# EAGLE design untitled_front4 (EAGLE 9.2.2)
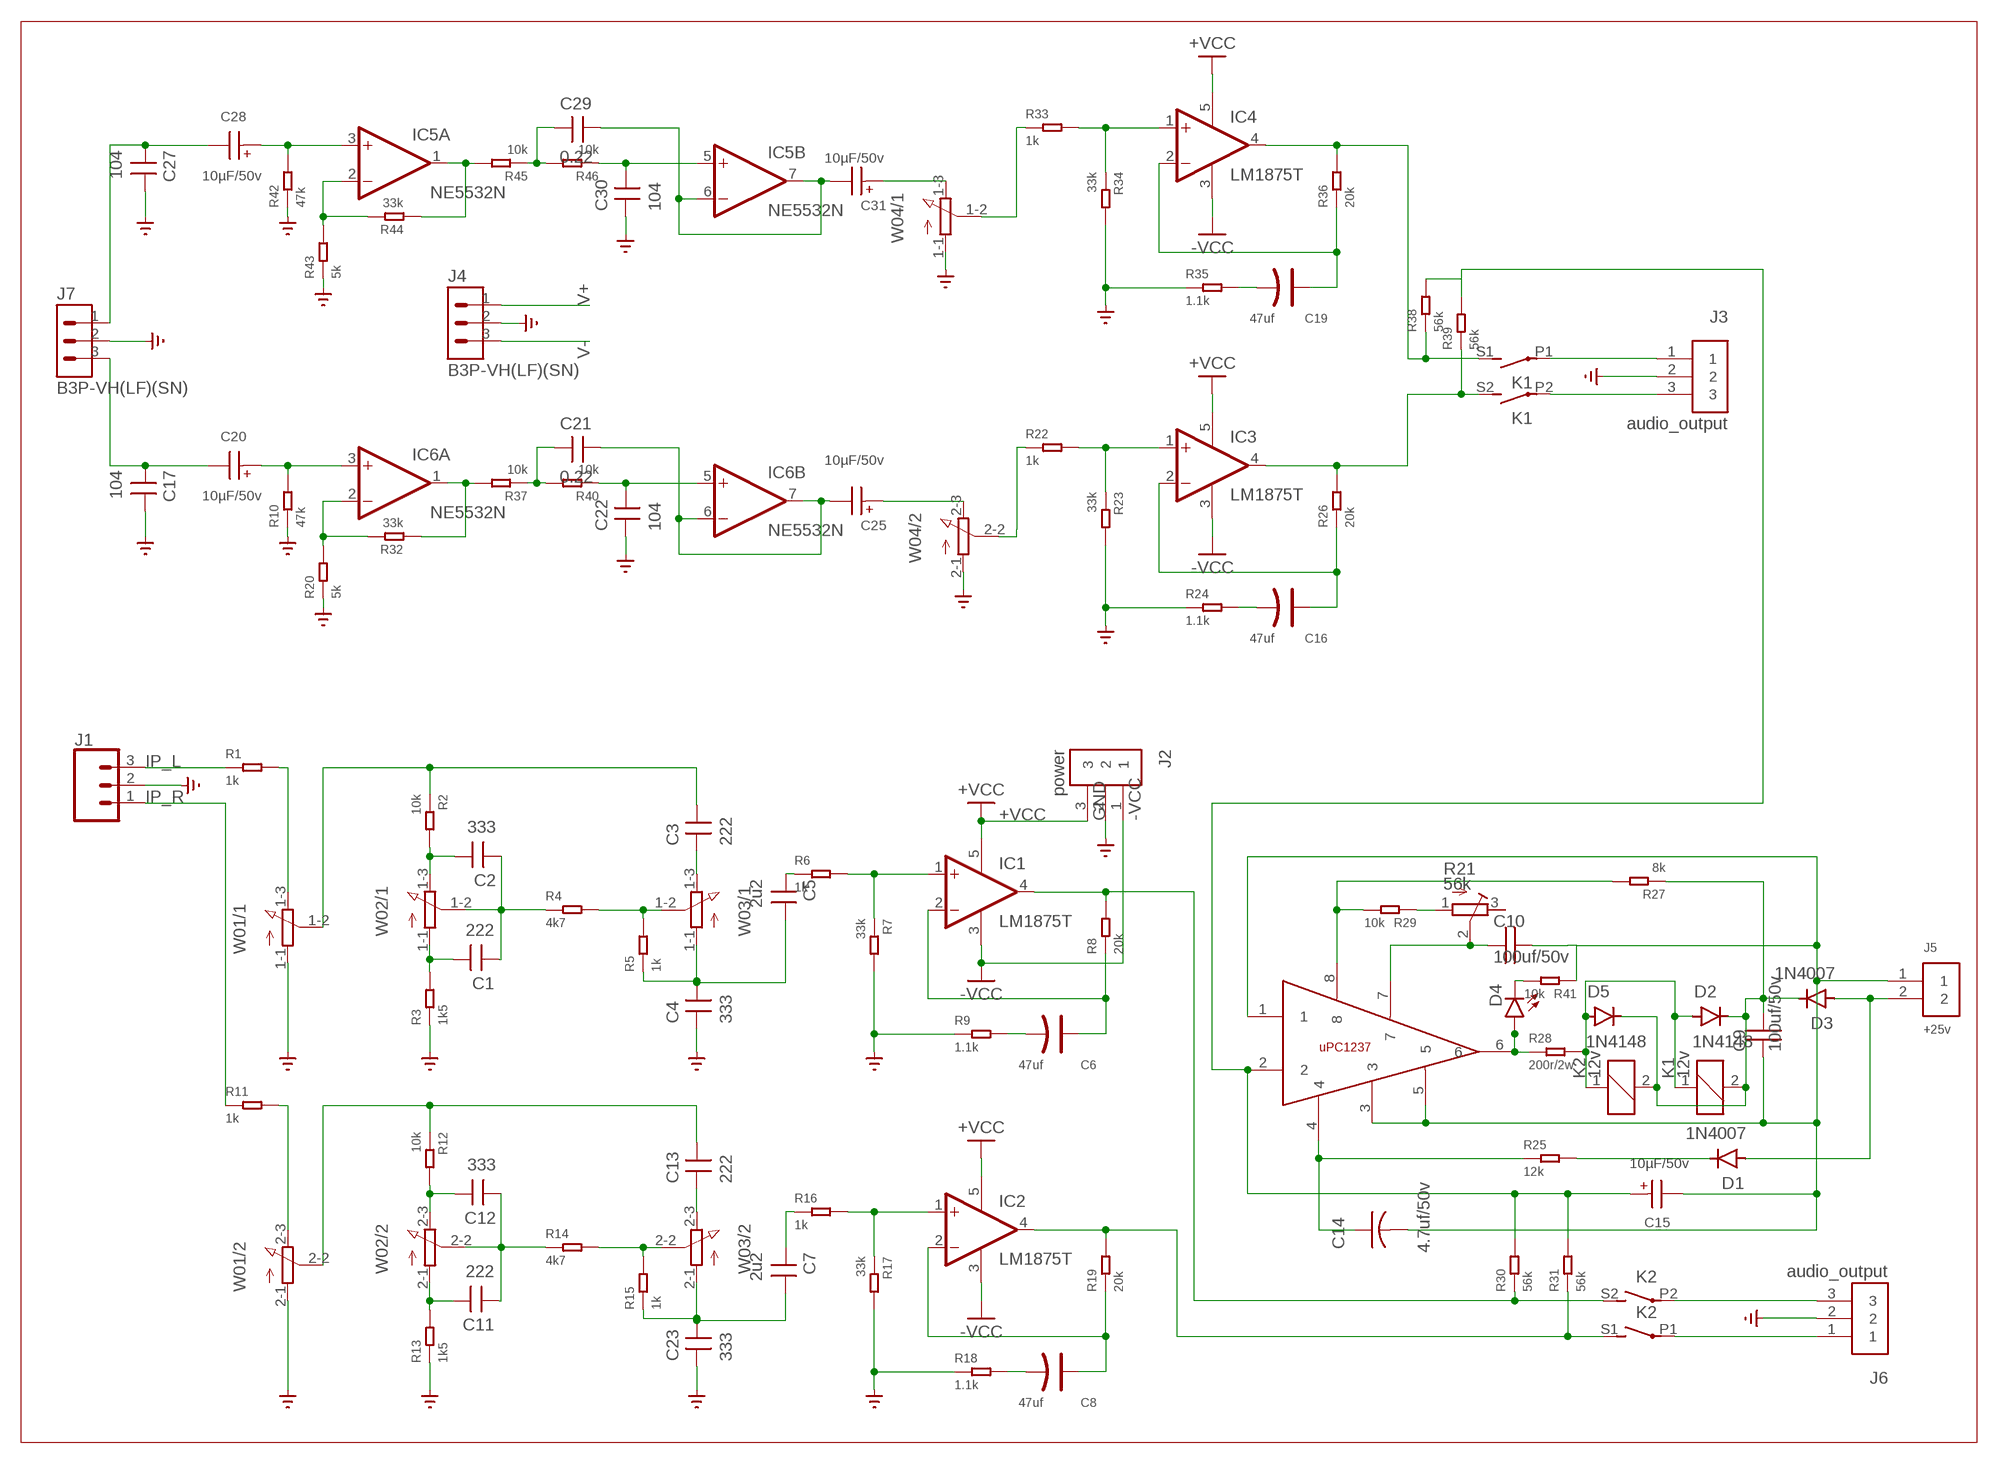
[diagram p0: schematic, sheet 1]

## Parts
C1  222  5.08MM-  [5.08MM-独石电容]
C2  333  5.08MM-  [5.08MM-独石电容]
C3  222  5.08MM-  [5.08MM-独石电容]
C4  333  5.08MM-  [5.08MM-独石电容]
C5  2u2  5.08MM-  [5.08MM-独石电容]
C6  47uf  DIP-ALUMINUM-47UF-16V(D5-H7MM)  [PC-D5.3MM]
C7  2u2  5.08MM-  [5.08MM-独石电容]
C8  47uf  DIP-ALUMINUM-47UF-16V(D5-H7MM)  [PC-D5.3MM]
C9  100uf/50v  50V100UF8X12  [8X12]
C10  100uf/50v  50V100UF8X12  [8X12]
C11  222  5.08MM-  [5.08MM-独石电容]
C12  333  5.08MM-  [5.08MM-独石电容]
C13  222  5.08MM-  [5.08MM-独石电容]
C14  4.7uf/50v  ECA-1HM2R2  [CAP_RADIAL_2MM]
C15  10µF/50v  WCAP-AT1H_5X11_860240272001  [WCAP-AT1H_5X11(DXL)]
C16  47uf  DIP-ALUMINUM-47UF-16V(D5-H7MM)  [PC-D5.3MM]
C17  104  5.08MM-  [5.08MM-独石电容]
C19  47uf  DIP-ALUMINUM-47UF-16V(D5-H7MM)  [PC-D5.3MM]
C20  10µF/50v  WCAP-AT1H_5X11_860240272001  [WCAP-AT1H_5X11(DXL)]
C21  0.22  5.08MM-  [5.08MM-独石电容]
C22  104  5.08MM-  [5.08MM-独石电容]
C23  333  5.08MM-  [5.08MM-独石电容]
C25  10µF/50v  WCAP-AT1H_5X11_860240272001  [WCAP-AT1H_5X11(DXL)]
C27  104  5.08MM-  [5.08MM-独石电容]
C28  10µF/50v  WCAP-AT1H_5X11_860240272001  [WCAP-AT1H_5X11(DXL)]
C29  0.22  5.08MM-  [5.08MM-独石电容]
C30  104  5.08MM-  [5.08MM-独石电容]
C31  10µF/50v  WCAP-AT1H_5X11_860240272001  [WCAP-AT1H_5X11(DXL)]
D1  1N4007  [DO-41]
D2  1N4148  1N4007  [DO-41]
D3  1N4007  [DO-41]
D4  BEAGLEBONE_BLUE_LED-3MM-NO_SILK  [BEAGLEBONE_BLUE_BEAGLEBONE_BLUE_LED3MM-NS]
D5  1N4148  1N4007  [DO-41]
IC1  LM1875T  [CB367]
IC2  LM1875T  [CB367]
IC3  LM1875T  [CB367]
IC4  LM1875T  [CB367]
IC5  NE5532N  [DIL08]
IC6  NE5532N  [DIL08]
J1  CONN_03POLAR  [MOLEX-1X3]
J2  power  691311400103  [TERMINALBLOCK_PLUGGABLE-3-7.62MM]
J3  audio_output  691311400103  [TERMINALBLOCK_PLUGGABLE-3-7.62MM]
J4  B3P-VH(LF)(SN)  [HDR-03]
J5  +25v  S2B-PH-K-S(LF)(SN)  [S2B-PH-K-S(LF)(SN)]
J6  audio_output  691311400103  [TERMINALBLOCK_PLUGGABLE-3-7.62MM]
J7  B3P-VH(LF)(SN)  [HDR-03]
K1  12v  G2R2A  [G2R2A]
K2  12v  G2R2A  [G2R2A]
R1  1k  DIP-RES-1M-5%-1/4W(PR-D2.3XL6.5MM)  [PR-D2.3XL6.5MM]
R2  10k  DIP-RES-1M-5%-1/4W(PR-D2.3XL6.5MM)  [PR-D2.3XL6.5MM]
R3  1k5  DIP-RES-1M-5%-1/4W(PR-D2.3XL6.5MM)  [PR-D2.3XL6.5MM]
R4  4k7  DIP-RES-1M-5%-1/4W(PR-D2.3XL6.5MM)  [PR-D2.3XL6.5MM]
R5  1k  DIP-RES-1M-5%-1/4W(PR-D2.3XL6.5MM)  [PR-D2.3XL6.5MM]
R6  1k  DIP-RES-1M-5%-1/4W(PR-D2.3XL6.5MM)  [PR-D2.3XL6.5MM]
R7  33k  DIP-RES-1M-5%-1/4W(PR-D2.3XL6.5MM)  [PR-D2.3XL6.5MM]
R8  20k  DIP-RES-1M-5%-1/4W(PR-D2.3XL6.5MM)  [PR-D2.3XL6.5MM]
R9  1.1k  DIP-RES-1M-5%-1/4W(PR-D2.3XL6.5MM)  [PR-D2.3XL6.5MM]
R10  47k  DIP-RES-1M-5%-1/4W(PR-D2.3XL6.5MM)  [PR-D2.3XL6.5MM]
R11  1k  DIP-RES-1M-5%-1/4W(PR-D2.3XL6.5MM)  [PR-D2.3XL6.5MM]
R12  10k  DIP-RES-1M-5%-1/4W(PR-D2.3XL6.5MM)  [PR-D2.3XL6.5MM]
R13  1k5  DIP-RES-1M-5%-1/4W(PR-D2.3XL6.5MM)  [PR-D2.3XL6.5MM]
R14  4k7  DIP-RES-1M-5%-1/4W(PR-D2.3XL6.5MM)  [PR-D2.3XL6.5MM]
R15  1k  DIP-RES-1M-5%-1/4W(PR-D2.3XL6.5MM)  [PR-D2.3XL6.5MM]
R16  1k  DIP-RES-1M-5%-1/4W(PR-D2.3XL6.5MM)  [PR-D2.3XL6.5MM]
R17  33k  DIP-RES-1M-5%-1/4W(PR-D2.3XL6.5MM)  [PR-D2.3XL6.5MM]
R18  1.1k  DIP-RES-1M-5%-1/4W(PR-D2.3XL6.5MM)  [PR-D2.3XL6.5MM]
R19  20k  DIP-RES-1M-5%-1/4W(PR-D2.3XL6.5MM)  [PR-D2.3XL6.5MM]
R20  5k  DIP-RES-1M-5%-1/4W(PR-D2.3XL6.5MM)  [PR-D2.3XL6.5MM]
R21  56k  R-TRIMM3296W  [RTRIM3296W]
R22  1k  DIP-RES-1M-5%-1/4W(PR-D2.3XL6.5MM)  [PR-D2.3XL6.5MM]
R23  33k  DIP-RES-1M-5%-1/4W(PR-D2.3XL6.5MM)  [PR-D2.3XL6.5MM]
R24  1.1k  DIP-RES-1M-5%-1/4W(PR-D2.3XL6.5MM)  [PR-D2.3XL6.5MM]
R25  12k  DIP-RES-1M-5%-1/4W(PR-D2.3XL6.5MM)  [PR-D2.3XL6.5MM]
R26  20k  DIP-RES-1M-5%-1/4W(PR-D2.3XL6.5MM)  [PR-D2.3XL6.5MM]
R27  8k  DIP-RES-1M-5%-1/4W(PR-D2.3XL6.5MM)  [PR-D2.3XL6.5MM]
R28  200r/2w  DIP-RES-1M-5%-1/4W(PR-D2.3XL6.5MM)  [PR-D2.3XL6.5MM]
R29  10k  DIP-RES-1M-5%-1/4W(PR-D2.3XL6.5MM)  [PR-D2.3XL6.5MM]
R30  56k  DIP-RES-1M-5%-1/4W(PR-D2.3XL6.5MM)  [PR-D2.3XL6.5MM]
R31  56k  DIP-RES-1M-5%-1/4W(PR-D2.3XL6.5MM)  [PR-D2.3XL6.5MM]
R32  33k  DIP-RES-1M-5%-1/4W(PR-D2.3XL6.5MM)  [PR-D2.3XL6.5MM]
R33  1k  DIP-RES-1M-5%-1/4W(PR-D2.3XL6.5MM)  [PR-D2.3XL6.5MM]
R34  33k  DIP-RES-1M-5%-1/4W(PR-D2.3XL6.5MM)  [PR-D2.3XL6.5MM]
R35  1.1k  DIP-RES-1M-5%-1/4W(PR-D2.3XL6.5MM)  [PR-D2.3XL6.5MM]
R36  20k  DIP-RES-1M-5%-1/4W(PR-D2.3XL6.5MM)  [PR-D2.3XL6.5MM]
R37  10k  DIP-RES-1M-5%-1/4W(PR-D2.3XL6.5MM)  [PR-D2.3XL6.5MM]
R38  56k  DIP-RES-1M-5%-1/4W(PR-D2.3XL6.5MM)  [PR-D2.3XL6.5MM]
R39  56k  DIP-RES-1M-5%-1/4W(PR-D2.3XL6.5MM)  [PR-D2.3XL6.5MM]
R40  10k  DIP-RES-1M-5%-1/4W(PR-D2.3XL6.5MM)  [PR-D2.3XL6.5MM]
R41  10k  DIP-RES-1M-5%-1/4W(PR-D2.3XL6.5MM)  [PR-D2.3XL6.5MM]
R42  47k  DIP-RES-1M-5%-1/4W(PR-D2.3XL6.5MM)  [PR-D2.3XL6.5MM]
R43  5k  DIP-RES-1M-5%-1/4W(PR-D2.3XL6.5MM)  [PR-D2.3XL6.5MM]
R44  33k  DIP-RES-1M-5%-1/4W(PR-D2.3XL6.5MM)  [PR-D2.3XL6.5MM]
R45  10k  DIP-RES-1M-5%-1/4W(PR-D2.3XL6.5MM)  [PR-D2.3XL6.5MM]
R46  10k  DIP-RES-1M-5%-1/4W(PR-D2.3XL6.5MM)  [PR-D2.3XL6.5MM]
U2  UPC1237HA  [SIP8]
W01  3RP/1610G  [3RP/1610G]
W02  3RP/1610G  [3RP/1610G]
W03  3RP/1610G  [3RP/1610G]
W04  3RP/1610G  [3RP/1610G]

## Nets
+VCC: IC1.5(V+) IC2.5(V+) IC3.5(V+) IC4.5(V+) J2.3
-VCC: IC1.3(V-) IC2.3(V-) IC3.3(V-) IC4.3(V-) J2.1
GND: C4.P$2 C17.P$1 C22.P$2 C23.P$2 C27.P$1 C30.P$2 J1.2 J2.2 J3.2 J4.2 J6.2 J7.2 R3.1 R7.2 R9.1 R10.1 R13.1 R17.2 R18.1 R20.1 R23.2 R24.1 R34.2 R35.1 R42.1 R43.1 W01.1-1(/1:A) W01.2-1(/2:A) W04.1-1(/1:A) W04.2-1(/2:A) ; supply symbol labelled SUPPLY0_GND_
IP_L: J1.3 R1.1
IP_R: J1.1 R11.1
N$1: R1.2 W01.1-3(/1:E)
N$2: D4.K(C) R41.2
N$3: C2.P$1 R2.2 W02.1-3(/1:E)
N$4: C1.P$1 R3.2 W02.1-1(/1:A)
N$5: R4.2 R5.2 W03.1-2(/1:S)
N$6: C1.P$2 C2.P$2 R4.1 W02.1-2(/1:S)
N$7: IC1.1(+IN) R6.2 R7.1
N$8: C4.P$1 C5.P$1 R5.1 W03.1-1(/1:A)
N$9: IC1.4(OUT) K2.S2(3:S) R8.2 R30.1
N$10: C6.+ IC1.2(-IN) R8.1
N$11: C5.P$2 R6.1
N$12: C6.- R9.2
N$13: C17.P$2 C20.2(-) J7.3
N$14: C3.P$2 W03.1-3(/1:E)
N$15: R11.2 W01.2-3(/2:E)
N$16: C27.P$2 C28.2(-) J7.1
N$17: C12.P$1 R12.2 W02.2-3(/2:E)
N$18: C11.P$1 R13.2 W02.2-1(/2:A)
N$19: R14.2 R15.2 W03.2-2(/2:S)
N$20: C11.P$2 C12.P$2 R14.1 W02.2-2(/2:S)
N$21: C7.P$1 C23.P$1 R15.1 W03.2-1(/2:A)
N$22: IC2.1(+IN) R16.2 R17.1
N$23: IC2.4(OUT) K2.S1(2:S) R19.2 R31.1
N$24: C8.+ IC2.2(-IN) R19.1
N$25: C7.P$2 R16.1
N$26: C8.- R18.2
N$27: C20.1(+) IC6.3(A:+IN) R10.2
N$28: C13.P$2 W03.2-3(/2:E)
N$29: J6.1 K2.P1(2:P)
N$30: J6.3 K2.P2(3:P)
N$31: D1.C R25.2
N$32: C10.1 R21.2(S) U2.7
N$33: R33.1 W04.1-2(/1:S)
N$34: IC3.1(+IN) R22.2 R23.1
N$35: IC3.4(OUT) K1.S2(3:S) R26.2 R39.1
N$36: C16.+ IC3.2(-IN) R26.1
N$37: R22.1 W04.2-2(/2:S)
N$38: C16.- R24.2
N$39: IC6.2(A:-IN) R20.2 R32.2
N$40: D1.A D3.A J5.2
N$41: D4.A R28.1 U2.6
N$42: D2.A D5.A K1.1 K2.1 R28.2
N$43: C9.2 D2.C D3.C D5.C K1.2 K2.2 R27.1
N$44: R27.2 R29.2 U2.8
N$45: R21.1(A) R29.1
N$46: J3.3 K1.P2(3:P)
N$47: C14.1 R25.1 U2.4
N$48: C15.1(+) R30.2 R31.2 R38.2 R39.2 U2.2
N$49: C28.1(+) IC5.3(A:+IN) R42.2
N$50: IC4.1(+IN) R33.2 R34.1
N$51: IC4.4(OUT) K1.S1(2:S) R36.2 R38.1
N$52: C19.+ IC4.2(-IN) R36.1
N$53: C3.P$1 R2.1 W01.1-2(/1:S)
N$54: C19.- R35.2
N$55: IC6.1(A:OUT) R32.1 R37.2
N$56: C9.1 C10.2 C14.2 C15.2(-) J5.1 R41.1 U2.1 U2.3 U2.5
N$57: J3.1 K1.P1(2:P)
N$58: C13.P$1 R12.1 W01.2-2(/2:S)
N$59: C21.P$2 R37.1 R40.2
N$60: C22.P$1 IC6.5(B:+IN) R40.1
N$61: C21.P$1 C25.2(-) IC6.6(B:-IN) IC6.7(B:OUT)
N$62: C29.P$1 C31.2(-) IC5.6(B:-IN) IC5.7(B:OUT)
N$63: IC5.2(A:-IN) R43.2 R44.2
N$64: IC5.1(A:OUT) R44.1 R45.2
N$65: C29.P$2 R45.1 R46.2
N$66: C30.P$1 IC5.5(B:+IN) R46.1
N$68: C31.1(+) W04.1-3(/1:E)
N$69: C25.1(+) W04.2-3(/2:E)
V+: J4.1
V-: J4.3
Unconnected: R21.3(E)

## Power pins joined to a net without a drawn wire
V+: IC5.8(P:V+) IC6.8(P:V+)
V-: IC5.4(P:V-) IC6.4(P:V-)

## Library data of the parts
C1-C5 C7 C11-C13 C17 C21-C23 C27 C29 C30 = Audio-Power-amlifier:5.08MM-; LONG: 5.08mm
C6 C8 C16 C19 = OPL_Capacitor:DIP-ALUMINUM-47UF-16V(D5-H7MM): 302030033; MPN: KS 100uF/16V; VALUE: 100uf
C9 C10 = Audio-Power-amlifier:50V100UF8X12
C14 = Resistor_Capacitor:ECA-1HM2R2: CAP ALUM 2.2UF 20% 50V RADIAL Manufacturer's datasheet <https://media.digikey.com/pdf/Data%20Sheets/Panasonic%20Electronic%20Components/ECA-xxM%20Series,TypeA.pdf>; CREATED_BY: PCBLayout.com; DIGIKEY_PART_NUMBER: P5175-ND; MANUFACTURER: Panasonic Electronic Components; MPN: ECA-1HM2R2; PACKAGE: CAP RADIAL 2MM LS
C15 C20 C25 C28 C31 = Wurth_Capacitors_WCAP-AT1H:WCAP-AT1H_5X11: WCAP-AT1H Aluminium Electrolytic Capacitors Long Life +105 °C Characteristics Long life product series Mounting style: THT Radial Capacitance range: 6.8 µF ‒ 3300 µF Capacitance tolerance: ±20 % Voltage range (UR): 10 ‒ 450 V(DC) Operating temperature: -40 °C up to +105 °C for UR ≤100 V(DC) -25 °C up to +105 °C for UR > 100 V(DC) Endurance: 5000 ‒ 10000 h @ +105 °C Dimensions (DxL) in mm: 5.0 x 11.0 up to 18.0 x 35.5 Recommended soldering: Wave soldering Applications Long life applications (industry, medical) Filtering Smoothing Energy storage Coupling e.g. Switched-mode power supply, AC/DC converter, adapter, charger, digital camera <https://www.we-online.com/catalog/media/o14727v209%20Family_WCAP-AT1H.jpg> Details see: https://www.we-online.com/catalog/en/WCAP-AT1H/ Updated by yingchun,Shan;2020-02-28 2020(C) Würth Elektronik; DATASHEET-URL: https://www.we-online.com/catalog/datasheet/860240272001.pdf; DF: 19%; DIAMETER: 5mm; I-LEAK: 4.7uA; I-RIPPLE: 100mA; L: 11mm; OPERATING-TEMPERATURE: -40 °C up to +105 °C; PART-NUMBER: 860240272001; PITCH: 2mm; TECHNICAL-REFERENCE: ATDC110470M010DSPA3E000; VALUE: 47 µF; VR: 10V(DC)
D1-D3 D5 = Diodes:1N4007: DIODE GEN PURP 1KV 1A DO41 Manufacturer's datasheet <https://www.mccsemi.com/pdf/Products/1N4001-1N4007(DO-41).pdf>; CREATED_BY: PCBLayout.com; DIGIKEY_PART_NUMBER: 1N4007MSCT-ND; MANUFACTURER: Micro Commercial Co; MPN: 1N4007; PACKAGE: DO-41
D4 = BeagleBone_Blue_R3:BEAGLEBONE_BLUE_LED: LEDs Standard schematic elements and footprints for 5mm, 3mm, 1206, and 0603 sized LEDs. 5mm - Spark Fun Electronics SKU : COM-00529 (and others)
IC1-IC4 = linear:LM1875T: Power OP AMP
IC5 IC6 = linear:NE5532: AUDIO AMPLIFIER
J1 = SparkFun-Connectors:CONN_03: Multi connection point. Often used as Generic Header-pin footprint for 0.1 inch spaced/style header connections On any of the 0.1 inch spaced packages, you can populate with these: Break Away Headers - Straight <https://www.sparkfun.com/products/116> (PRT-00116) Break Away Male Headers - Right Angle <https://www.sparkfun.com/products/553> (PRT-00553) Female Headers <https://www.sparkfun.com/products/115> (PRT-00115) Break Away Headers - Machine Pin <https://www.sparkfun.com/products/117> (PRT-00117) Break Away Female Headers - Swiss Machine Pin <https://www.sparkfun.com/products/743> (PRT-00743) Stackable Header - 3 Pin (Female, 0.1") <https://www.sparkfun.com/products/13875> (PRT-13875) For SCREWTERMINALS and SPRING TERMINALS visit here: Screw Terimnals on SparkFun.com <https://www.sparkfun.com/search/results?term=Screw+Terminals> (5mm/3.5mm/2.54mm spacing) This device is also useful as a general connection point to wire up your design to another part of your project. Our various solder wires solder well into these plated through hole pads. Hook-Up Wire - Assortment (Stranded, 22 AWG) <https://www.sparkfun.com/products/11375> (PRT-11375) Hook-Up Wire - Assortment (Solid Core, 22 AWG) <https://www.sparkfun.com/products/11367> (PRT-11367) View the entire wire category on our website here <https://www.sparkfun.com/categories/141> Special notes: Molex polarized connector foot print use with SKU : PRT-08232 with associated crimp pins and housings.; PROD_ID: CONN-08625; SF_ID: PRT-08096
J2 J3 J6 = Terminal Blocks:691311400103: 7.62MM CLOSE VERTICAL PCB HEADER WR-TBL Manufacturer's datasheet <https://katalog.we-online.com/em/datasheet/6913114001xx.pdf>; CREATED_BY: PCBLayout.com; DIGIKEY_PART_NO: 732-2824-ND; MANUFACTURER: WURTH ELEKTRONIK; MPN: 691311400103
J4 J7 = Connectors:B3P-VH(LF)(SN): CONN HEADER VERT 3POS 3.96MM Manufacturer's datasheet <http://www.jst-mfg.com/product/pdf/eng/eVH.pdf>; CREATED_BY: PCBLayout.com; DIGIKEY_PART_NUMBER: 455-1640-ND; MANUFACTURER: JST Sales America Inc.; MPN: B3P-VH(LF)(SN)
J5 = Connectors:S2B-PH-K-S(LF)(SN): CONN HEADER R/A 2POS 2MM Manufacturer's datasheet <http://www.jst-mfg.com/product/pdf/eng/ePH.pdf>; CREATED_BY: PCBLayout.com; DIGI_KEY_PART_NUMBER: 455-1719-ND; MANUFACTURER: JST Sales America Inc.; MPN: S2B-PH-K-S(LF)(SN)
K1 K2 = relay:G2R2A: RELAY 2 x norm. open, Omron; MPN: G2R-2A-DC24; OC_FARNELL: 6985269; OC_NEWARK: 36M5257
R1-R20 R22-R46 = OPL_Resistor:DIP-RES-1M-5%-1/4W(PR-D2.3XL6.5MM): 301020005; MPN: FHCFR-1/4W-105J; VALUE: 1M
R21 = rcl:R-TRIMM: Trimm resistor; SPICEMODEL: X; SPICEPREFIXL: POT
U2 = Audio-Power-amlifier:UPC1237HA
W01-W04 = pot:3RP/1610G: 16mm Potentiometer two level Source: http://www.alphapotentiometers.net/html/16mm_pot_2.html

## Board
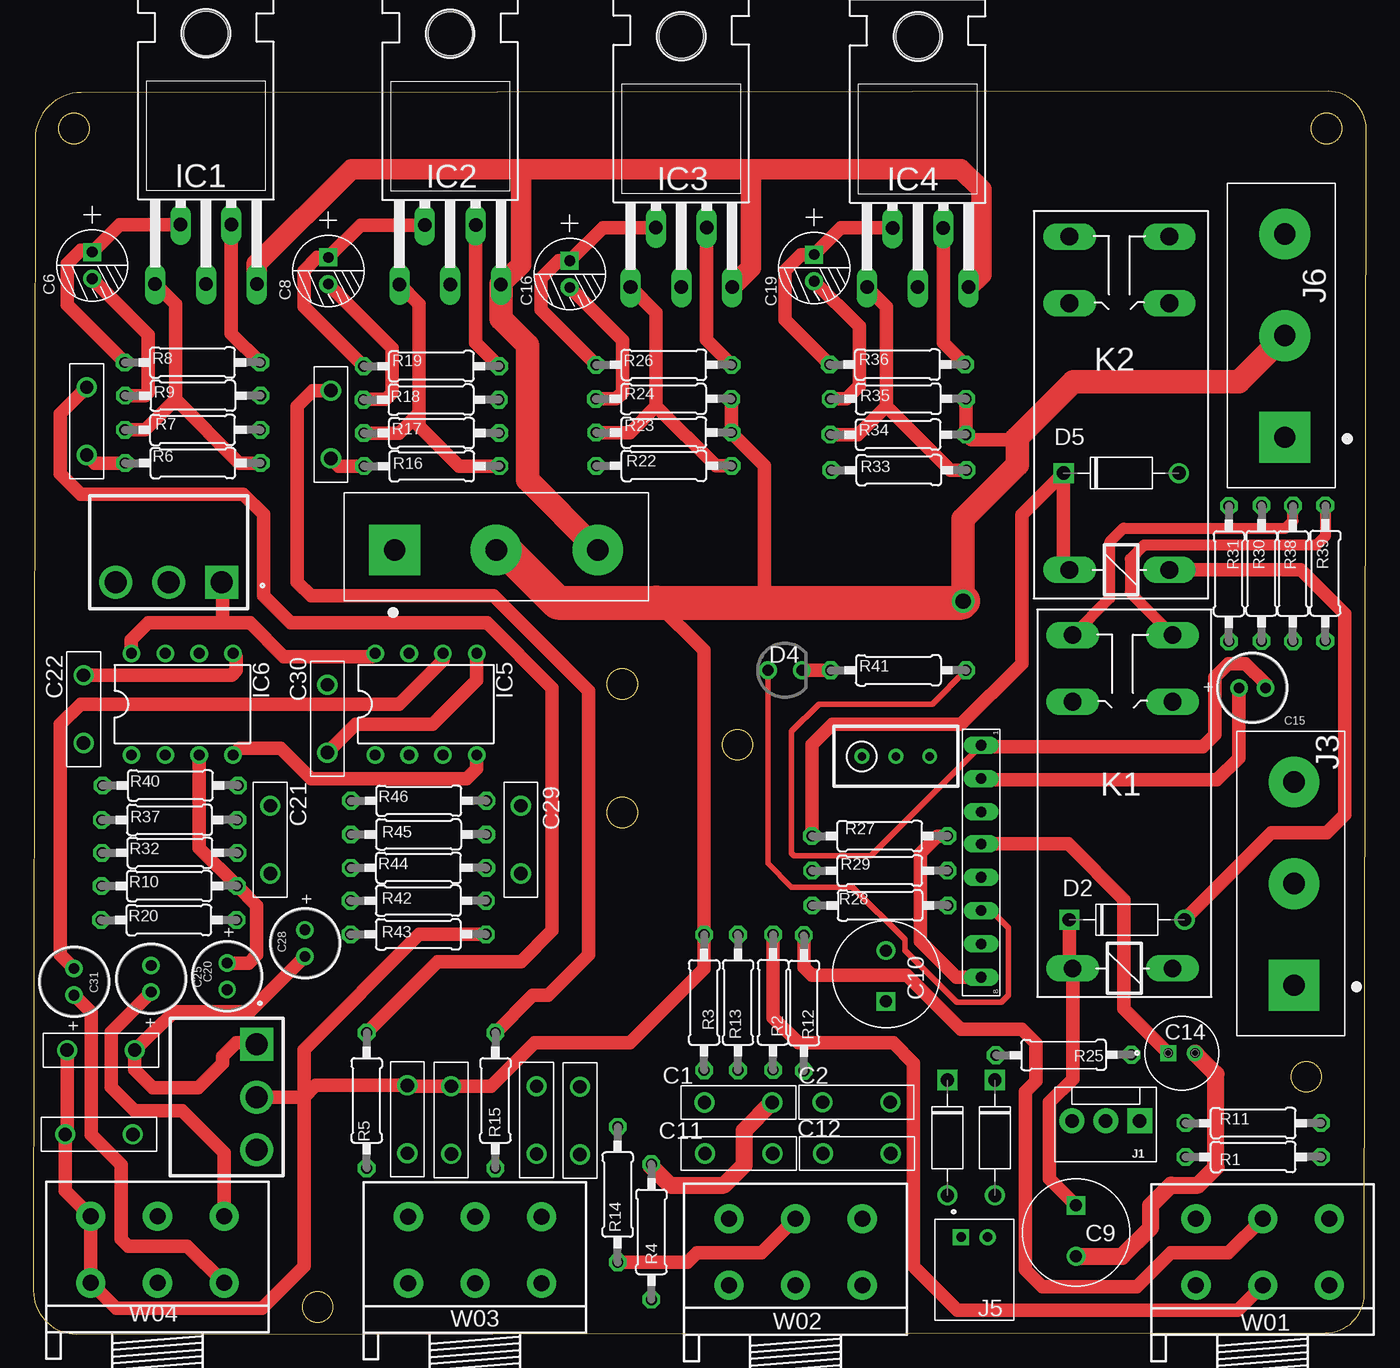
[diagram p1: board, top side]
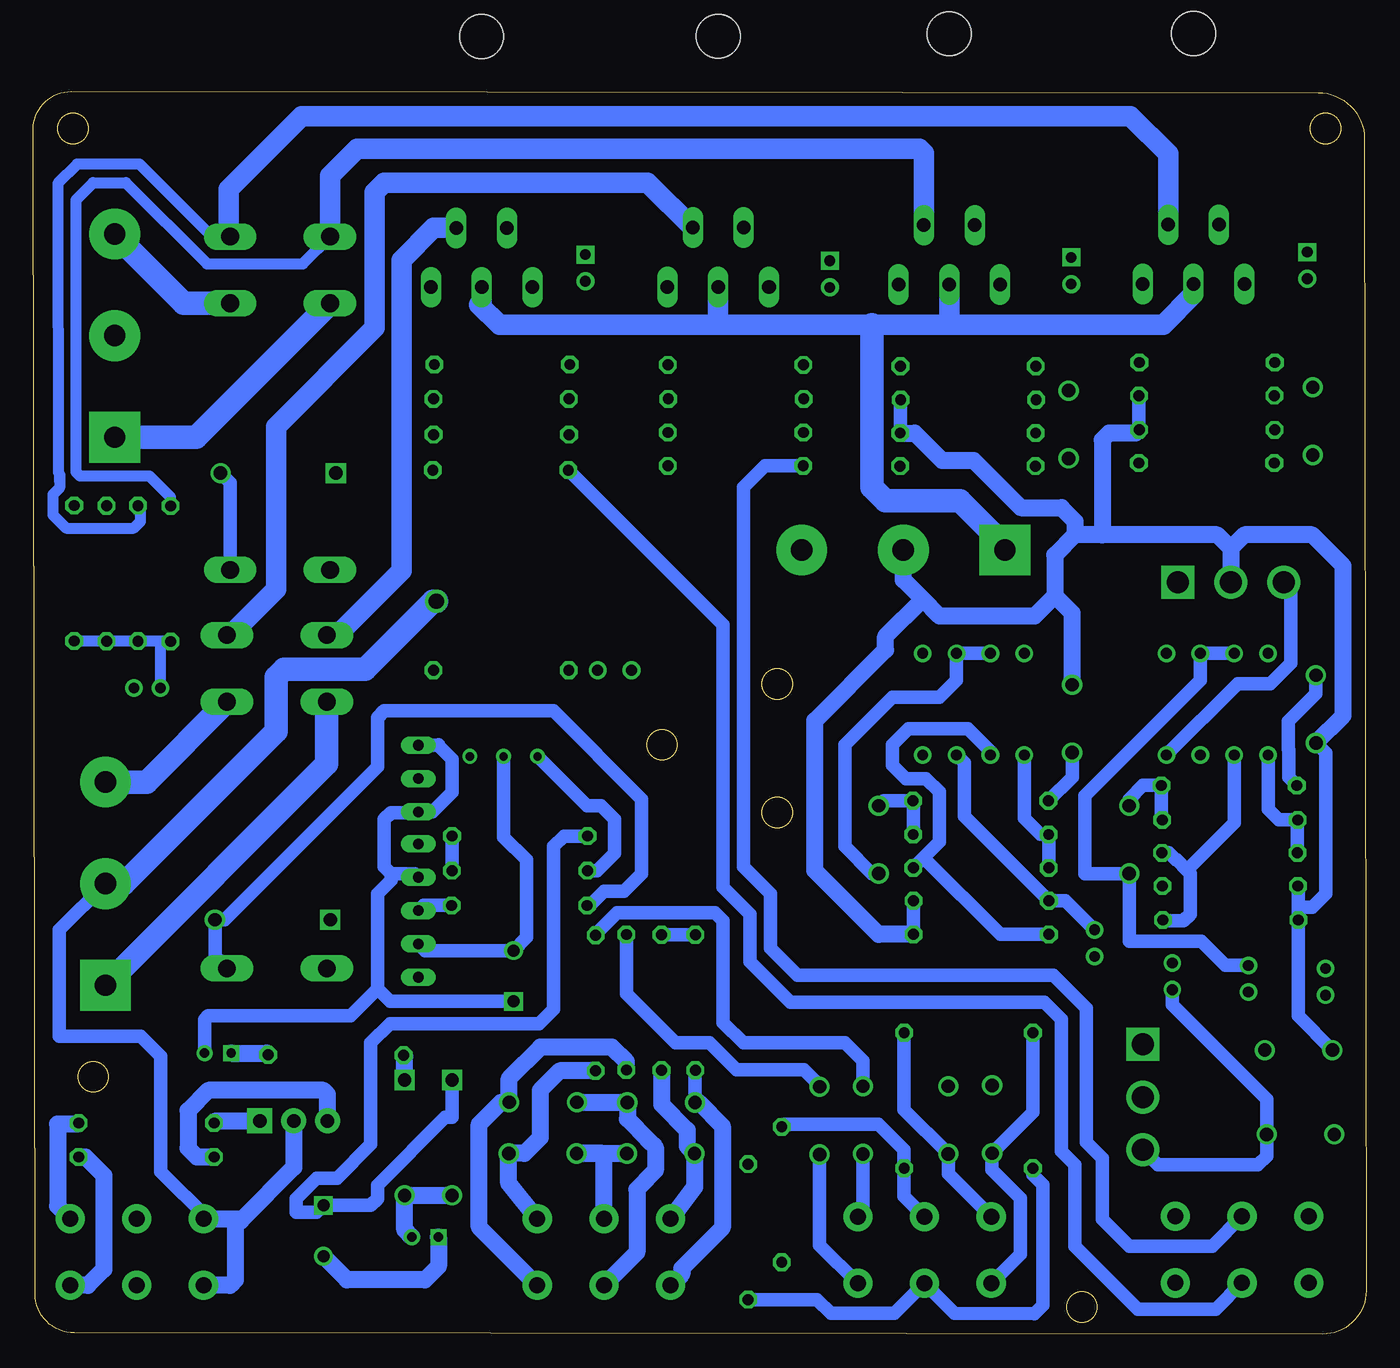
[diagram p2: board, bottom side, seen from below]

Size 99.99 x 93.2 mm. Coordinates in mm from the lower left corner, seen from the top.
Outline: 0.13,89.64 0,3.27 arc90 3.27,0 96.91,0.09 arc90 99.86,3.03 99.99,90.34 arc90 97.14,93.2 3.6,93.11 arc90 0.13,89.64
Copper layers (1*16): Top 0.035mm / dielectric 1.5mm / Bottom 0.035mm
Design rules "default": minimum track width 6mil, minimum drill 0.35mm, track to track 6mil, track to pad 6mil, pad to pad 6mil, via to via 6mil, smd to smd 6mil, copper to edge 40mil, drill to drill 6mil, minimum pad ring 10mil, minimum via ring 8mil, stop-mask expansion 4mil, vias tented up to drill 0mil, thermal gap 10mil
Milling: area 1.9,89.3 to 4.2,91.6; area 95.9,89.3 to 98.2,91.6; area 94.4,18.2 to 96.6,20.4; area 20.2,0.9 to 22.5,3.2; area 43.1,47.6 to 45.3,49.9; area 51.7,43.1 to 54,45.3; area 43.1,38 to 45.3,40.3

### Footprints (pad centres in the part's own frame; a part is rotated, then mirrored left to right if it is on the bottom)
5.08MM-独石电容 = drill 1: P$1 -2.54,0; P$2 2.54,0
PC-D5.3MM = drill 0.8 pad 1.35 square: + -1,0 | drill 0.8 pad 1.35: - 1,0
8X12 = drill 0.9: 1 -1.778,0 | drill 0.9 square: 2 2.032,0
CAP_RADIAL_2MM = drill 0.7 pad 1.1 square: 1 -1,0 | drill 0.7 pad 1.1: 2 1,0
WCAP-AT1H_5X11(DXL) = drill 0.8: 1 1,0; 2 -1,0
DO-41 = drill 1: A 4.325,0 | drill 1 square: C -4.325,0
BEAGLEBONE_BLUE_BEAGLEBONE_BLUE_LED3MM-NS = drill 0.813: A -1.27,0; K 1.27,0
CB367 = drill 1.016 long: 1 -3.81,-11.43; 2 -1.905,-6.985; 3 0,-11.43; 4 1.905,-6.985; 5 3.81,-11.43 | hole 3.302: 0,7.366
DIL08 = drill 0.813 pad 1.27: 1 -3.81,-3.81; 2 -1.27,-3.81; 3 1.27,-3.81; 4 3.81,-3.81; 5 3.81,3.81; 6 1.27,3.81; 7 -1.27,3.81; 8 -3.81,3.81
MOLEX-1X3 = drill 1.016 pad 1.88 square: 1 0,0 | drill 1.016 pad 1.88: 2 2.54,0; 3 5.08,0
TERMINALBLOCK_PLUGGABLE-3-7.62MM = drill 1.6 pad 3.81 square: 1 -7.62,0 | drill 1.6 pad 3.81: 2 0,0; 3 7.62,0
HDR-03 = drill 1.65 square: 1 -3.96,0 | drill 1.65: 2 0,0; 3 3.96,0
S2B-PH-K-S(LF)(SN) = drill 0.7 square: 1 -1,0 | drill 0.7: 2 1,0
G2R2A = drill 1.321 long: 1 -2.54,-3.683; 2 -2.54,3.81; P1 17.45,3.81; P2 17.45,-3.683; S1 22.454,3.81; S2 22.454,-3.683
PR-D2.3XL6.5MM = drill 0.813 octagon: 1 -4.953,0; 2 5.207,0
RTRIM3296W = drill 0.61: 1 0,-2.54; 2 0,0; 3 0,2.54
SIP8 = drill 0.8 long: 1 -8.8,3.6; 2 -6.3,3.6; 3 -3.8,3.6; 4 -1.4,3.6; 5 1.1,3.6; 6 3.6,3.6; 7 6.1,3.6; 8 8.6,3.6
3RP/1610G = drill 1.2 pad 2.184: 1-1 -5,0; 1-2 0,0; 1-3 5,0; 2-1 -5,5; 2-2 0,5; 2-3 5,5

### Placement (x,y rotation side)
C1  52.89,17.37 0 top
C2  61.75,17.39 180 top
C3  41,16.02 270 top
C4  28.06,16.11 90 top
C5  4.01,68.47 270 top
C6  4.42,80.14 270 top
C7  22.33,68.22 270 top
C8  22.13,79.74 270 top
C9  78.23,7.62 90 top
C10  63.97,26.99 270 top
C11  52.92,13.55 0 top
C12  61.78,13.55 180 top
C13  37.75,16.06 270 top
C14  86.14,21.08 0 top
C15  91.44,48.47 180 top
C16  40.24,79.49 270 top
C17  4.93,14.98 0 top
C19  58.58,79.96 270 top
C20  14.54,26.83 90 top
C21  17.78,37.08 90 top
C22  3.77,46.87 270 top
C23  31.35,16.06 90 top
C25  8.84,26.65 270 top
C27  5.07,21.3 0 top
C28  20.38,29.32 90 top
C29  36.57,37.08 90 top
C30  22.06,46.16 90 top
C31  3.05,26.42 270 top
D1  72.13,14.73 270 top
D2  82.04,31.07 0 top
D3  68.58,14.73 270 top
D4  56.38,49.78 0 top
D5  81.62,64.57 0 top
IC1  12.95,90.19 0 top
IC2  31.27,90.15 0 top
IC3  48.61,89.97 0 top
IC4  66.36,89.95 0 top
IC5  29.46,47.24 0 top
IC6  11.17,47.24 0 top
J1  82.99,15.99 180 top
J2  34.72,58.8 0 top
J3  94.57,33.78 90 top
J4  10.16,56.39 180 top
J5  70.59,7.28 0 top
J6  93.89,74.88 90 top
J7  16.76,17.78 270 top
K1  81.78,29.97 90 top
K2  81.54,59.86 90 top
R1  91.38,13.29 0 top
R2  55.5,25.01 270 top
R3  50.32,25 270 top
R4  46.36,7.8 270 top
R5  25.01,17.65 270 top
R6  11.84,65.33 0 top
R7  11.82,67.82 0 top
R8  11.81,72.87 0 top
R9  12.1,70.38 180 top
R10  10.08,33.61 0 top
R11  91.38,15.83 0 top
R12  57.81,24.96 270 top
R13  52.86,25 270 top
R14  43.84,10.34 90 top
R15  34.66,17.65 270 top
R16  29.76,65.1 0 top
R17  29.75,67.58 0 top
R18  29.96,70.08 180 top
R19  29.74,72.59 0 top
R20  10.04,31.06 0 top
R21  64.7,43.32 270 top
R22  47.18,65.12 0 top
R23  47.17,67.61 0 top
R24  47.4,70.14 180 top
R25  77.42,20.94 180.2 top
R26  47.17,72.69 0 top
R27  63.37,37.36 0 top
R28  63.65,32.15 180 top
R29  63.38,34.76 0 top
R30  92.14,57.18 270 top
R31  89.69,57.16 270 top
R32  10.11,36.1 0 top
R33  64.8,64.8 0 top
R34  64.75,67.46 0 top
R35  65.02,70.14 180 top
R36  64.7,72.72 0 top
R37  10.34,38.56 180 top
R38  94.49,57.17 270 top
R39  96.92,57.19 270 top
R40  10.16,41.15 0 top
R41  65.02,49.78 180 top
R42  29.01,32.51 180 top
R43  29.01,29.98 180 top
R44  28.77,34.97 0 top
R45  29.03,37.47 180 top
R46  28.79,40 0 top
U2  67.51,35.36 270 top
W01  92.23,3.66 0 top
W02  57.18,3.67 0 top
W03  33.13,3.81 0 top
W04  9.31,3.84 0 top

### Tracks (layer width: path | path; a pad name or v marks a point on that pad's centre or on a via)
+VCC
  Top 1.524: IC1.5 16.76,80.26 23.87,87.38 36.57,87.38 | IC4.5 71.12,79.46 71.12,85.85 69.59,87.38 53.84,87.38 | 36.57,87.38 53.84,87.38 | IC3.5 53.84,79.96 53.84,87.38 | IC2.5 36.57,80.21 36.57,87.38
  Top 1.778: IC2.5 35.08,76.16 37.08,74.17 37.08,64.07 J2.3
-VCC
  Bottom 1.524: IC1.3 12.95,77.98 15.24,75.69 30.98,75.69 | 30.98,75.69 37.08,75.69 48.76,75.69 | 48.76,75.69 65.02,75.69 66.54,77.22 66.36,77.4 IC4.3 | IC3.3 48.61,75.85 48.76,75.69 | IC2.3 31.27,75.98 30.98,75.69
  Bottom 1.778: J2.1 27.1,59.11 30.48,62.48 36.06,62.48 37.08,63.5 37.08,75.69
GND  (via drill 1.14)
  Top 1.016: C23.P$2 34.34,18.6 37.59,21.84 44.75,21.84 50.32,27.41 R3.1 50.32,51.27 46.73,54.86 | C23.P$2 31.29,18.65 | C23.P$2 28.12,18.6 C4.P$2 21.19,18.65 20.32,17.78 | R24.1 52.38,70.11 R23.2 54.86,65.14 54.86,54.86 | R35.1 69.97,67.47 R34.2 70.36,67.06 73.66,67.06 | C27.P$1 2.53,15.12 C17.P$1 2.39,10.77 W04.2-1 W04.1-1 6.21,1.95 17.17,1.95 20.32,5.09 20.32,17.78 | 20.32,17.78 J7.2 | R43.1 28.96,29.98 20.32,21.34 20.32,17.78
  Top 1.778: J6.2 90.43,71.42 78.02,71.42 73.83,67.23 | 73.83,67.23 73.66,67.06 | 73.83,67.23 73.83,65.2 69.75,61.12 v69.75,54.97
  Top 2.54: J2.2 35.39,58.8 39.33,54.86 46.73,54.86 54.86,54.86 69.65,54.86 v69.75,54.97
  Bottom 1.016: 94.23,33.78 J3.2 98.04,30.32 98.04,22.35 91.94,22.35 90.42,20.83 90.42,12.19 86.89,8.66 | R3.1 R13.1 | R9.1 17.05,67.84 R7.2 | R17.2 34.96,70.04 R18.1 | 5.09,32 R20.1 5.09,23.86 C27.P$1 | 5.09,32 5.09,33.57 R10.1 | C22.P$2 3.04,43.6 3.04,33.02 4.06,32 5.09,32 | R43.1 R42.1
  Bottom 1.27: J1.2 80.45,12.51 84.32,8.64 | 84.32,8.64 86.86,8.64 86.89,8.66 W01.2-1 | 84.32,8.64 84.83,8.13 84.83,4.06 85.24,3.66 W01.1-1 | C22.P$2 1.73,46.38 1.73,53.85 1.73,57.62 4.06,59.94 9.14,59.94 10.16,58.93 | 10.16,58.93 J4.2 | 10.16,58.93 11.17,59.94 19.81,59.94 | 19.81,59.94 21.84,59.94 | 21.84,59.94 23.36,58.42 23.36,55.37 | 23.36,55.37 24.89,53.85 32,53.85 33.27,55.12 | 33.27,55.12 34.72,56.57 J2.2 | R7.2 17.28,67.56 19.3,67.56 19.81,67.06 19.81,59.94 | R17.2 33.86,67.58 31.81,65.53 29.46,65.53 25.9,61.98 22.86,61.98 21.84,60.96 21.84,59.94 | C30.P$2 22.06,54.07 23.36,55.37 | R43.1 36.58,29.98 41.37,34.77 41.37,46 36.06,51.31 36.06,52.32 33.27,55.12
  Bottom 1.778: J3.2 93.21,33.78 81.78,45.21 81.78,49.28 81.18,49.88 75.08,49.88 70,54.97 v69.75,54.97
IP_L
  Bottom 1.27: J1.3 77.91,17.98 78.23,18.29 86.86,18.29 88.39,16.76 88.39,13.95 87.73,13.29 R1.1
IP_R
  Bottom 1.27: R11.1 86.27,15.99 J1.1
N$1
  Bottom 1.27: R1.2 96.09,13.29 94.7,11.9 94.7,4.86 95.9,3.66 W01.1-3
N$2
  Top 1.016: D4.K R41.2
N$3
  Bottom 1.27: R2.2 55.5,20.45 56.58,21.53 61.95,21.53 64.29,19.19 C2.P$1 64.9,17.39 66.54,15.75 66.54,8.03 W02.1-3
N$4
  Bottom 1.016: 50.06,17.37 C1.P$1 50.35,19.77 R3.2
  Bottom 1.27: 50.06,17.37 48.29,15.6 48.29,7.98 51.34,4.94 51.34,4.51 W02.1-1
N$5
  Bottom 1.016: R5.2 25.01,11.96 24.26,11.22 24.26,2.17 24.89,1.54 30.87,1.55 W03.1-2 35.38,1.56 39.62,1.56 40.16,1.56 41.19,2.59 R4.2
N$6
  Top 1.27: R4.1 46.36,12.56 47.75,11.18 51.81,11.18 53.34,12.7 53.34,15.28 C1.P$2
  Bottom 1.27: C2.P$2 59.19,17.37 C1.P$2 55.43,16.14 53.88,14.59 53.88,14.56 53.33,14.01 53.33,12.29 54.02,11.6 54.02,11.55 54.71,10.86 54.71,6.14 W02.1-2
N$7
  Top 1.016: R7.1 8.38,67.82 10.66,70.1 | 10.66,70.1 10.66,77.23 IC1.1 | 10.66,70.1 15.44,65.33 R6.2
N$8
  Top 1.016: C5.P$1 2.03,69.03 2.03,64.52 3.55,62.99 15.74,62.99 17.27,61.47 17.27,55.37 19.3,53.34 34.03,53.34 38.92,48.46 38.92,30.28 36.57,27.94 30.34,27.94 R5.1
  Bottom 1.016: R5.1 25.01,16.63 C4.P$1 28.06,12.32 25.95,10.21 25.95,5.99 W03.1-1
N$9
  Top 1.016: IC1.4 14.85,75.03 R8.2
  Bottom 0.813: K2.S2 86.58,82.31 92.02,87.75 96.71,87.75 98.15,86.31 98.12,64.61 98.02,64.52 | 98.02,63.99 98.02,64.52 | 98.02,64.52 98.02,63.47 98.52,62.96 98.52,62.48 98.52,61.44 97.53,60.45 92.45,60.45 91.94,60.96 91.94,61.94 R30.1
  Bottom 1.524: K2.S2 85.34,82.43 85.34,85.85 79.85,91.35 18.28,91.35 17.68,91.34 14.85,88.52 IC1.4
N$10
  Top 1.016: IC1.2 6.48,83.2 C6.+ 4.28,81.28 3.55,81.28 2.54,80.26 2.54,77.19 R8.1
N$11
  Top 1.016: R6.1 4.61,65.33 C5.P$2
N$12
  Top 1.016: C6.- 8.63,74.93 8.63,70.61 8.4,70.38 R9.2
N$13
  Bottom 1.016: C20.2 14.54,24.71 7.47,17.63 C17.P$2 7.47,13.36 8.12,12.7 15.64,12.7 J7.3
N$14
  Bottom 1.016: C3.P$2 41,6.68 W03.1-3
N$15
  Bottom 1.27: R11.2 96.67,15.75 98.17,15.75 98.17,9.61 W01.2-3
N$16
  Top 1.016: C28.2 16.25,24.19 10.56,24.19 9.07,22.7 9.01,22.7 C27.P$2 7.61,19.82 8.95,18.48 12.38,18.48 14.22,20.32 14.22,20.83 15.24,21.84 16.66,21.84 J7.1
N$17
  Bottom 1.27: W02.2-3 64.32,11.3 C12.P$1 63.15,13.55 61.97,14.73 61.97,18.29 60.51,19.75 R12.2
N$18
  Bottom 1.27: W02.2-1 50.38,11.04 C11.P$1 50.93,14.1 50.93,15.31 52.86,17.24 R13.2
N$19
  Bottom 1.016: W03.2-2 34.66,10.34 R15.2 34.66,13.84 36.57,15.75 43.64,15.75 R14.2
N$20
  Top 1.016: R14.1 49.07,5.39 49.78,6.1 54.61,6.1 W02.2-2
  Bottom 1.27: C11.P$2 C12.P$2 59.22,13.57 57.43,13.57 57.18,13.32 W02.2-2
N$21
  Top 1.016: C7.P$1 20.97,70.76 19.81,69.6 19.81,56.39 20.82,55.37 34.54,55.37 41.64,48.27 41.64,28.44 38.6,25.4 37.45,25.4 R15.1
  Bottom 1.016: W03.2-1 31.35,12.03 C23.P$1 34.66,16.83 R15.1
N$22
  Top 1.016: R17.1 27.44,67.58 28.95,69.09 | IC2.1 28.95,77.23 28.95,69.09 | R16.2 31.93,65.1 28.95,68.07 28.95,69.09
N$23
  Top 1.016: IC2.4 33.18,74.35 R19.2
  Bottom 0.813: K2.S1 79.77,80.26 86.95,80.26 93.05,86.36 95.5,86.36 96.79,85.07 96.79,64.65 96.48,64.34 91.26,64.34 89.69,62.77 R31.1
  Bottom 1.524: IC2.4 33.18,88.56 33.52,88.9 75.71,88.9 77.73,86.88 K2.S1
N$24
  Top 1.016: IC2.2 24.55,83.17 C8.+ 21.3,80.74 20.32,79.76 20.32,77.06 R19.1
N$25
  Top 1.016: R16.1 22.91,65.1 C7.P$2
N$26
  Top 1.016: R18.2 24.79,70.1 26.41,70.1 26.92,70.61 26.92,73.95 C8.-
N$27
  Top 1.016: IC6.3 12.44,36.45 R10.2 16.76,32.14 16.76,28.45 16.14,27.83 C20.1
N$28
  Bottom 1.016: C13.P$2 37.75,9.19 W03.2-3
N$29
  Bottom 1.778: K2.P1 87.77,67.26 J6.1
N$30
  Bottom 1.778: J6.3 88.69,77.31 K2.P2
N$31
  Bottom 1.27: D1.C 72.13,20.84 R25.2
N$32
  Bottom 1.016: U2.7 70.61,28.76 C10.1 62.99,29.75 62.99,35.56 64.7,37.27 R21.2
N$33
  Bottom 1.016: R33.1 48.26,53.2 48.26,33.53 46.22,31.5 46.22,27.94 43.18,24.89 24.14,24.89 22.86,23.61 22.86,13.72 21.84,12.7 21.84,6.6 17.12,1.88 11.27,1.88 W04.1-2
N$34
  Top 1.016: R23.1 44.75,67.61 46.73,69.6 | IC3.1 46.73,76.61 46.73,69.6 | 46.73,69.6 51.21,65.12 R22.2
N$35
  Top 0.813: K1.S2 82.29,55.6 82.29,58.13 83.33,59.16 96.24,59.16 96.92,59.84 R39.1
  Top 1.016: R26.2 50.52,74.56 IC3.4
  Bottom 1.524: IC3.4 53.89,86.36 73.66,86.36 74.37,85.65 74.37,75.48 81.78,68.06 81.78,55.88 85.24,52.43 K1.S2
N$36
  Top 1.016: IC3.2 42.73,82.98 C16.+ 39.42,80.49 38.1,79.17 38.1,76.82 R26.1
N$37
  Bottom 1.016: W04.2-2 11.55,6.6 17.78,6.6 19.81,8.64 19.81,13.21 21,14.4 21,24.46 23.46,26.92 42.67,26.92 44.7,28.96 44.7,33.02 46.73,35.05 46.73,63.5 45.12,65.12 R22.1
N$38
  Top 1.016: C16.- 44.19,74.54 44.19,70.61 43.72,70.14 R24.2
N$39
  Bottom 1.016: R32.2 14.81,36.1 14.27,35.56 14.22,35.56 13.46,34.8 9.9,38.35 IC6.2 | 13.2,34.54 13.2,31.5 13.71,30.99 15.18,30.99 R20.2
N$40
  Bottom 1.27: J5.2 72.13,7.81 D1.A D3.A
N$41
  Top 0.406: U2.6 71.86,31.76 73.15,30.48 73.15,25.4 72.64,24.89 69.3,24.89 65.39,28.81 65.39,29.61 61.46,33.53 56.89,33.53 55.11,35.31 D4.A
  Bottom 1.016: R28.1 70.72,32.15 U2.6
N$42
  Top 1.016: K2.1 95.08,57.32 98.38,54.02 98.37,41.48 98.37,38.94 97.02,37.59 92.88,37.59 D2.A
  Bottom 1.016: R28.2 58.24,32.15 57.18,33.21 55.69,33.21 54.35,34.54 54.35,40.13 60.96,46.74 73.66,46.74 74.16,46.23 74.16,42.55 85.64,31.07 D2.A 86.36,28.33 K1.1 | D5.A 85.22,63.85 K2.1
N$43
  Top 1.016: C9.2 76.24,11.64 76.24,17.38 77.97,19.12 K1.2 77.71,27.69 D2.C | R27.1 58.42,44.2 59.94,45.72 69.59,45.72 74.16,50.29 74.16,61.45 D5.C 77.29,57.75 K2.2
  Bottom 1.016: R27.1 60.18,37.36 60.96,36.58 60.96,24.38 62.05,23.29 73.22,23.29 74.67,21.84 74.67,14.22 77.21,11.68 78.74,11.68 80.26,10.16 80.26,9.14 78.74,9.14 C9.2 74.67,9.65 74.16,10.16 74.16,11.18 69.08,16.26 68.58,16.26 D3.C
N$44
  Top 1.016: U2.8 69.24,26.76 66.54,29.46 66.54,36.07 67.83,37.36 R27.2
  Bottom 1.016: R27.2 R29.2
N$45
  Bottom 1.016: R29.1 57.69,34.76 56.38,36.07 56.38,38.61 57.4,39.62 58.46,39.62 R21.1
N$46
  Bottom 1.778: K1.P2 91.48,41.4 J3.3
N$47
  Top 1.016: U2.4 77.64,36.76 81.82,32.59 81.82,24.4 C14.1
  Bottom 1.27: C14.1 82.49,21.08 R25.1
N$48
  Top 1.016: C15.1 90.44,43.2 88.8,41.56 71.21,41.56 U2.2
  Bottom 0.813: R31.2 90.42,51.95 | 90.42,51.95 92.12,51.95 R30.2 96.91,51.98 R39.2 94.52,51.99 R38.2 | C15.1 90.44,51.93 90.42,51.95
N$49
  Bottom 1.016: IC5.3 30.15,42.85 30.15,38.85 R42.2 22.56,32.51 C28.1
N$50
  Top 1.016: R34.1 61.87,67.46 64,69.6 | IC4.1 64,77.06 64,69.6 | R33.2 68.8,64.8 64,69.6
N$51
  Top 0.813: K1.S1 80.77,55.22 80.77,59.44 81.78,60.45 93.98,60.45 94.49,60.97 R38.1
  Top 1.016: IC4.4 68.26,74.36 R36.2
  Bottom 1.524: K1.S1 77.18,52.43 72.37,57.24 72.37,80.54 69.94,82.96 IC4.4
N$52
  Top 1.016: IC4.2 60.58,82.96 C19.+ 57.6,80.96 56.38,79.74 56.38,76.08 R36.1
N$53
  Top 1.016: R2.1 55.5,23.75 57.4,21.84 64.51,21.84 66.04,20.32 66.04,5.08 69.32,1.79 90.36,1.8 W01.1-2
  Bottom 1.016: R2.1 55.5,25.53 51.81,21.84 49.27,21.84 47.24,19.81 42.16,19.81 41,18.66 C3.P$1
N$54
  Top 1.016: C19.- 61.97,75.57 61.97,71.12 60.99,70.14 R35.2
N$55
  Bottom 1.016: R32.1 5.16,38.54 R37.2 6.55,38.56 7.36,39.37 IC6.1
N$56
  Top 0.406: R41.1 67.43,47.24 58.92,47.24 56.89,45.21 56.89,36.07 57.07,35.89 62.83,35.89 U2.1
  Top 1.016: C15.2 92.44,48.78 90.93,50.29 89.65,50.29 88.62,49.26 88.62,44.94 87.74,44.06 71.21,44.06 U2.1
  Top 1.27: C14.2 88.73,19.49 88.73,12.53 87.37,11.18 85.34,11.18 83.82,9.65 83.82,8 81.66,5.84 C9.1
  Bottom 1.016: U2.1 69.62,44.16 | 69.62,44.16 69.59,44.2 | 69.62,44.16 68.58,43.11 68.58,40.64 70.05,39.16 U2.3 71.15,39.12 73.15,39.12 73.66,38.61 73.66,35.05 73.15,34.54 | U2.5 71.39,34.54 73.15,34.54 | C10.2 73.21,24.95 74.16,25.91 | 74.16,25.91 74.16,33.02 73.15,34.04 73.15,34.54 | 74.16,25.91 76.2,23.88 86.86,23.88 87.14,23.6 C14.2
  Bottom 1.27: J5.1 69.59,5.08 70.61,4.06 76.45,4.06 C9.1
N$57
  Bottom 1.778: K1.P1 77.97,42.76 J3.1
N$58
  Top 1.016: W01.2-2 89.66,6.1 85.34,6.1 82.8,3.56 75.69,3.56 74.42,4.82 74.42,18.17 75.22,18.97 75.22,21.8 74.16,22.86 69.59,22.86 65.53,26.92 58.42,26.92 57.81,27.53 R12.1
  Bottom 1.016: C13.P$1 37.75,20.49 39.11,21.84 46.73,21.84 48.26,23.37 48.26,30.99 48.85,31.59 56.21,31.59 57.81,29.99 R12.1
N$59
  Bottom 1.016: R37.1 15.36,38.63 R40.2 16.76,41.15 17.78,40.13 C21.P$2
N$60
  Top 1.016: C22.P$1 14.86,49.41 15.24,49.78 15.24,50.8 IC6.5
  Bottom 1.016: C22.P$1 3.77,48.04 5.84,45.97 5.84,43.86 5.8,43.83 5.8,41.75 R40.1
N$61
  Bottom 1.016: IC6.7 IC6.6 12.44,49.02 21.09,40.38 21.09,34.54 C21.P$1 17.78,29.47 12.37,29.47 10.55,27.65 C25.2
N$62
  Top 1.016: IC5.6 30.73,50.55 27.43,47.24 3.55,47.24 2.03,45.72 2.03,28.45 C31.2
  Bottom 1.016: IC5.7 IC5.6 30.73,49.02 32,47.75 35.56,47.75 39.11,44.2 39.11,36.58 37.08,34.54 C29.P$1
N$63
  Bottom 1.016: IC5.2 28.19,43.71 29.89,45.41 34.34,45.41 35.56,44.2 35.56,42.67 34.54,41.66 33.02,41.66 32.02,40.66 32.02,36.92 33.2,35.74 | 33.2,35.74 R44.2 | R43.2 27.43,29.98 33.2,35.74
N$64
  Bottom 1.016: R44.1 R45.2 24.44,37.47 25.65,38.69 IC5.1
N$65
  Bottom 1.016: R45.1 33.98,39.98 R46.2 36.19,40 C29.P$2
N$66
  Top 1.016: IC5.5 33.27,49.02 29.97,45.72 24.16,45.72 C30.P$1
  Bottom 1.016: C30.P$1 22.06,41.78 R46.1
N$68
  Top 1.016: W04.1-3 11.55,6.6 7.11,6.6 6.6,7.11 6.6,12.7 4.34,14.96 4.34,24.13 C31.1
N$69
  Top 1.016: C25.1 5.85,22.66 5.85,18.53 7.62,16.76 11.17,16.76 14.31,13.62 W04.2-3
V+
  Top 1.016: IC6.8 7.36,52.07 8.63,53.34 14.22,53.34 | 14.22,53.34 16.25,53.34 18.79,50.8 25.4,50.8 IC5.8 | J4.1 14.22,56.28 14.22,53.34
V-
  Top 1.016: IC6.4 15.49,43.94 18.54,43.94 20.82,41.66 32.51,41.66 33.27,42.42 IC5.4
  Bottom 1.016: IC6.4 9.65,48.77 7.18,48.77 5.65,50.3 5.65,55.84 J4.3